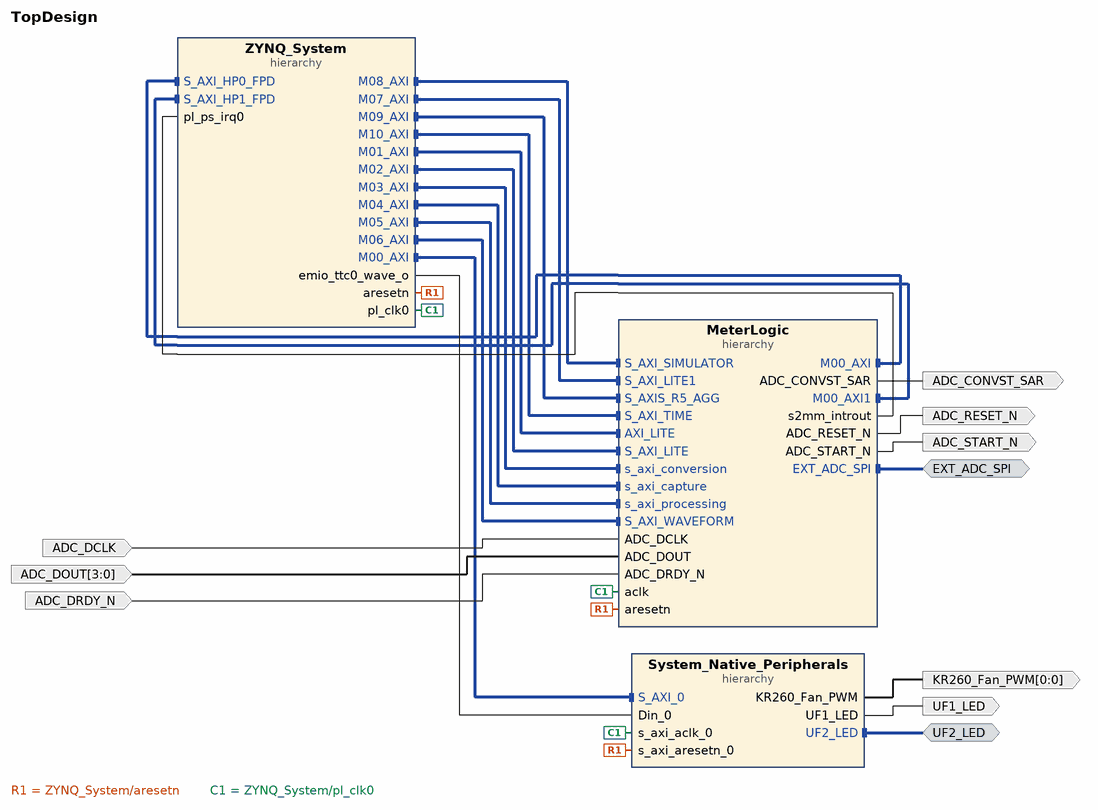
[diagram p0: block diagram of the top level]
# Vivado block design TopDesign, xck26-sfvc784-2LV-c, Vivado 2025.2
create_bd_design TopDesign

create_bd_intf_port -mode Master -vlnv xilinx.com:interface:gpio_rtl:1.0 UF2_LED
create_bd_intf_port -mode Master -vlnv xilinx.com:interface:spi_rtl:1.0 EXT_ADC_SPI
create_bd_port -dir O -from 0 -to 0 KR260_Fan_PWM
create_bd_port -dir O UF1_LED
create_bd_port -dir I -type clk ADC_DCLK
set_property -dict {CONFIG.FREQ_HZ 8192000} [get_bd_ports ADC_DCLK]
create_bd_port -dir O ADC_CONVST_SAR
create_bd_port -dir O ADC_RESET_N
create_bd_port -dir O ADC_START_N
create_bd_port -dir I ADC_DRDY_N
create_bd_port -dir I -from 3 -to 0 ADC_DOUT

create_bd_cell -type hier System_Native_Peripherals
create_bd_cell -type hier MeterLogic
create_bd_cell -type hier ZYNQ_System

# ---- hierarchy /System_Native_Peripherals ----
current_bd_instance /System_Native_Peripherals
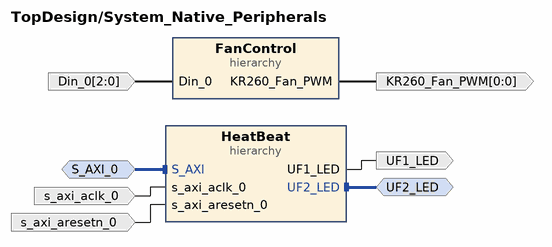
[diagram p1: block diagram inside /System_Native_Peripherals]
create_bd_intf_pin -mode Master -vlnv xilinx.com:interface:gpio_rtl:1.0 UF2_LED
create_bd_intf_pin -mode Slave -vlnv xilinx.com:interface:aximm_rtl:1.0 S_AXI_0
create_bd_pin -dir I -from 2 -to 0 Din_0
create_bd_pin -dir O -from 0 -to 0 KR260_Fan_PWM
create_bd_pin -dir O UF1_LED
create_bd_pin -dir I -type clk s_axi_aclk_0
create_bd_pin -dir I -type rst s_axi_aresetn_0

create_bd_cell -type hier FanControl
create_bd_cell -type hier HeatBeat

# ---- hierarchy /System_Native_Peripherals/FanControl ----
current_bd_instance /System_Native_Peripherals/FanControl
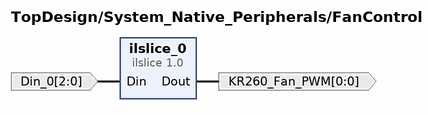
[diagram p2: block diagram inside /System_Native_Peripherals/FanControl]
create_bd_pin -dir I -from 2 -to 0 Din_0
create_bd_pin -dir O -from 0 -to 0 KR260_Fan_PWM

create_bd_cell -type inline_hdl -vlnv xilinx.com:inline_hdl:ilslice:1.0 ilslice_0
set_property -dict {CONFIG.DIN_FROM 2 CONFIG.DIN_TO 2 CONFIG.DIN_WIDTH 3} [get_bd_cells ilslice_0]

# ---- hierarchy /System_Native_Peripherals/HeatBeat ----
current_bd_instance /System_Native_Peripherals/HeatBeat
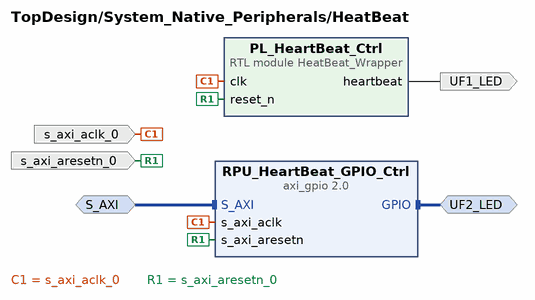
[diagram p3: block diagram inside /System_Native_Peripherals/HeatBeat]
create_bd_intf_pin -mode Slave -vlnv xilinx.com:interface:aximm_rtl:1.0 S_AXI
create_bd_intf_pin -mode Master -vlnv xilinx.com:interface:gpio_rtl:1.0 UF2_LED
create_bd_pin -dir I -type clk s_axi_aclk_0
create_bd_pin -dir I -type rst s_axi_aresetn_0
create_bd_pin -dir O UF1_LED

create_bd_cell -type ip -vlnv xilinx.com:ip:axi_gpio:2.0 RPU_HeartBeat_GPIO_Ctrl
set_property -dict {CONFIG.C_ALL_OUTPUTS 1 CONFIG.C_GPIO_WIDTH 1} [get_bd_cells RPU_HeartBeat_GPIO_Ctrl]
create_bd_cell -type module -reference HeatBeat_Wrapper PL_HeartBeat_Ctrl

# ---- hierarchy /MeterLogic ----
current_bd_instance /MeterLogic
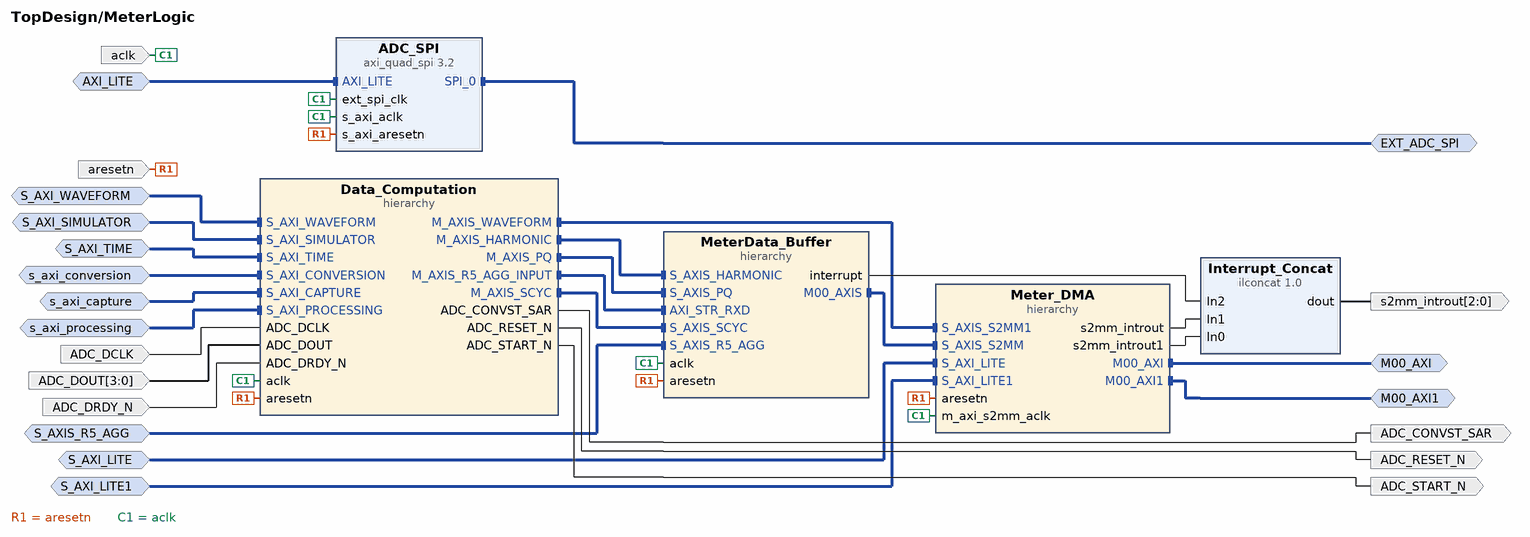
[diagram p4: block diagram inside /MeterLogic]
create_bd_intf_pin -mode Slave -vlnv xilinx.com:interface:aximm_rtl:1.0 AXI_LITE
create_bd_intf_pin -mode Master -vlnv xilinx.com:interface:spi_rtl:1.0 EXT_ADC_SPI
create_bd_intf_pin -mode Slave -vlnv xilinx.com:interface:aximm_rtl:1.0 S_AXI_LITE1
create_bd_intf_pin -mode Slave -vlnv xilinx.com:interface:aximm_rtl:1.0 S_AXI_SIMULATOR
create_bd_intf_pin -mode Slave -vlnv xilinx.com:interface:aximm_rtl:1.0 S_AXI_WAVEFORM
create_bd_intf_pin -mode Slave -vlnv xilinx.com:interface:aximm_rtl:1.0 s_axi_processing
create_bd_intf_pin -mode Slave -vlnv xilinx.com:interface:aximm_rtl:1.0 s_axi_conversion
create_bd_intf_pin -mode Slave -vlnv xilinx.com:interface:aximm_rtl:1.0 s_axi_capture
create_bd_intf_pin -mode Master -vlnv xilinx.com:interface:aximm_rtl:1.0 M00_AXI1
create_bd_intf_pin -mode Master -vlnv xilinx.com:interface:aximm_rtl:1.0 M00_AXI
create_bd_intf_pin -mode Slave -vlnv xilinx.com:interface:aximm_rtl:1.0 S_AXI_LITE
create_bd_intf_pin -mode Slave -vlnv xilinx.com:interface:aximm_rtl:1.0 S_AXIS_R5_AGG
create_bd_intf_pin -mode Slave -vlnv xilinx.com:interface:aximm_rtl:1.0 S_AXI_TIME
create_bd_pin -dir I -type clk aclk
create_bd_pin -dir I -type rst aresetn
create_bd_pin -dir O -from 2 -to 0 -type intr s2mm_introut
create_bd_pin -dir O ADC_CONVST_SAR
create_bd_pin -dir O ADC_START_N
create_bd_pin -dir O ADC_RESET_N
create_bd_pin -dir I -from 3 -to 0 ADC_DOUT
create_bd_pin -dir I ADC_DRDY_N
create_bd_pin -dir I -type clk ADC_DCLK

create_bd_cell -type hier Meter_DMA
create_bd_cell -type ip -vlnv xilinx.com:ip:axi_quad_spi:3.2 ADC_SPI
set_property -dict {CONFIG.Multiples16 2} [get_bd_cells ADC_SPI]
create_bd_cell -type hier MeterData_Buffer
create_bd_cell -type inline_hdl -vlnv xilinx.com:inline_hdl:ilconcat:1.0 Interrupt_Concat
set_property -dict {CONFIG.NUM_PORTS 3} [get_bd_cells Interrupt_Concat]
create_bd_cell -type hier Data_Computation

# ---- hierarchy /MeterLogic/Meter_DMA ----
current_bd_instance /MeterLogic/Meter_DMA
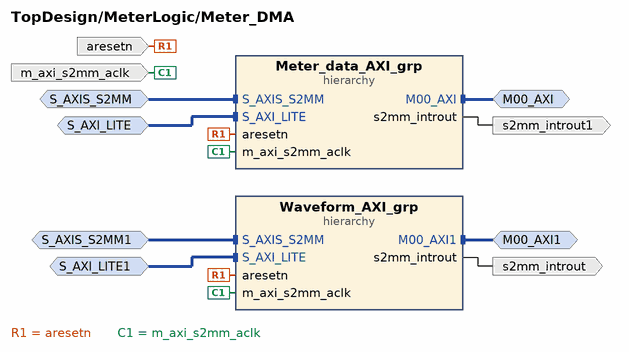
[diagram p5: block diagram inside /MeterLogic/Meter_DMA]
create_bd_intf_pin -mode Slave -vlnv xilinx.com:interface:axis_rtl:1.0 S_AXIS_S2MM1
create_bd_intf_pin -mode Slave -vlnv xilinx.com:interface:aximm_rtl:1.0 S_AXI_LITE1
create_bd_intf_pin -mode Master -vlnv xilinx.com:interface:aximm_rtl:1.0 M00_AXI1
create_bd_intf_pin -mode Master -vlnv xilinx.com:interface:aximm_rtl:1.0 M00_AXI
create_bd_intf_pin -mode Slave -vlnv xilinx.com:interface:axis_rtl:1.0 S_AXIS_S2MM
create_bd_intf_pin -mode Slave -vlnv xilinx.com:interface:aximm_rtl:1.0 S_AXI_LITE
create_bd_pin -dir I -type clk m_axi_s2mm_aclk
create_bd_pin -dir I -type rst aresetn
create_bd_pin -dir O -type intr s2mm_introut
create_bd_pin -dir O -type intr s2mm_introut1

create_bd_cell -type hier Waveform_AXI_grp
create_bd_cell -type hier Meter_data_AXI_grp

# ---- hierarchy /MeterLogic/Meter_DMA/Waveform_AXI_grp ----
current_bd_instance /MeterLogic/Meter_DMA/Waveform_AXI_grp
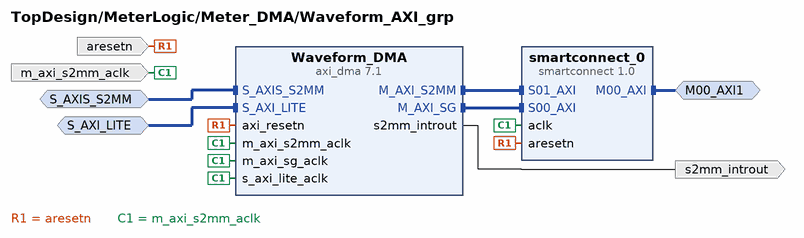
[diagram p6: block diagram inside /MeterLogic/Meter_DMA/Waveform_AXI_grp]
create_bd_intf_pin -mode Slave -vlnv xilinx.com:interface:aximm_rtl:1.0 S_AXI_LITE
create_bd_intf_pin -mode Slave -vlnv xilinx.com:interface:axis_rtl:1.0 S_AXIS_S2MM
create_bd_intf_pin -mode Master -vlnv xilinx.com:interface:aximm_rtl:1.0 M00_AXI1
create_bd_pin -dir I -type clk m_axi_s2mm_aclk
create_bd_pin -dir I -type rst aresetn
create_bd_pin -dir O -type intr s2mm_introut

create_bd_cell -type ip -vlnv xilinx.com:ip:smartconnect:1.0 smartconnect_0
create_bd_cell -type ip -vlnv xilinx.com:ip:axi_dma:7.1 Waveform_DMA
set_property -dict [list \
  CONFIG.c_include_mm2s 0 \
  CONFIG.c_m_axi_s2mm_data_width 128 \
  CONFIG.c_s_axis_s2mm_tdata_width 32 \
  CONFIG.c_sg_include_stscntrl_strm 0 \
  CONFIG.c_sg_length_width 16 \
] [get_bd_cells Waveform_DMA]

# ---- hierarchy /MeterLogic/Meter_DMA/Meter_data_AXI_grp ----
current_bd_instance /MeterLogic/Meter_DMA/Meter_data_AXI_grp
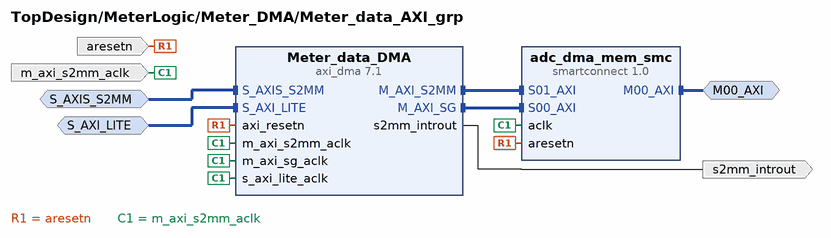
[diagram p7: block diagram inside /MeterLogic/Meter_DMA/Meter_data_AXI_grp]
create_bd_intf_pin -mode Slave -vlnv xilinx.com:interface:aximm_rtl:1.0 S_AXI_LITE
create_bd_intf_pin -mode Slave -vlnv xilinx.com:interface:axis_rtl:1.0 S_AXIS_S2MM
create_bd_intf_pin -mode Master -vlnv xilinx.com:interface:aximm_rtl:1.0 M00_AXI
create_bd_pin -dir I -type clk m_axi_s2mm_aclk
create_bd_pin -dir I -type rst aresetn
create_bd_pin -dir O -type intr s2mm_introut

create_bd_cell -type ip -vlnv xilinx.com:ip:axi_dma:7.1 Meter_data_DMA
set_property -dict [list \
  CONFIG.c_include_mm2s 0 \
  CONFIG.c_include_sg 1 \
  CONFIG.c_m_axi_s2mm_data_width 128 \
  CONFIG.c_s_axis_s2mm_tdata_width 32 \
  CONFIG.c_sg_include_stscntrl_strm 0 \
  CONFIG.c_sg_length_width 16 \
] [get_bd_cells Meter_data_DMA]
create_bd_cell -type ip -vlnv xilinx.com:ip:smartconnect:1.0 adc_dma_mem_smc
set_property -dict {CONFIG.NUM_SI 2} [get_bd_cells adc_dma_mem_smc]

# ---- hierarchy /MeterLogic/MeterData_Buffer ----
current_bd_instance /MeterLogic/MeterData_Buffer
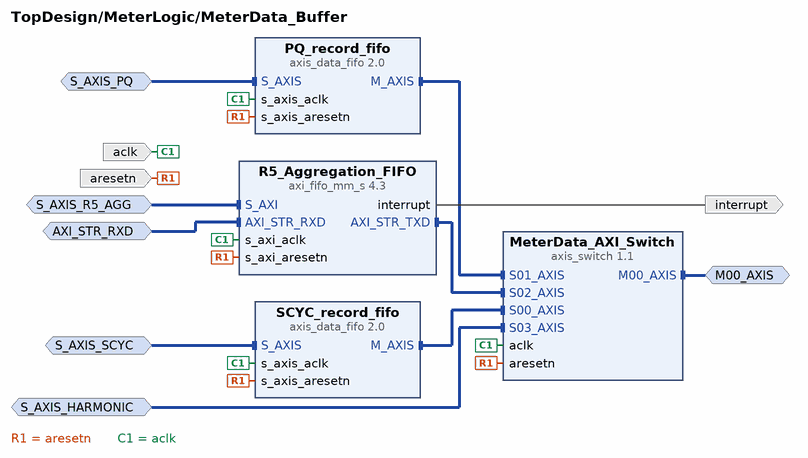
[diagram p8: block diagram inside /MeterLogic/MeterData_Buffer]
create_bd_intf_pin -mode Master -vlnv xilinx.com:interface:axis_rtl:1.0 M00_AXIS
create_bd_intf_pin -mode Slave -vlnv xilinx.com:interface:axis_rtl:1.0 S_AXIS_SCYC
create_bd_intf_pin -mode Slave -vlnv xilinx.com:interface:axis_rtl:1.0 S_AXIS_PQ
create_bd_intf_pin -mode Slave -vlnv xilinx.com:interface:axis_rtl:1.0 AXI_STR_RXD
create_bd_intf_pin -mode Slave -vlnv xilinx.com:interface:aximm_rtl:1.0 S_AXIS_R5_AGG
create_bd_intf_pin -mode Slave -vlnv xilinx.com:interface:axis_rtl:1.0 S_AXIS_HARMONIC
create_bd_pin -dir I -type rst aresetn
create_bd_pin -dir I -type clk aclk
create_bd_pin -dir O -type intr interrupt

create_bd_cell -type ip -vlnv xilinx.com:ip:axis_switch:1.1 MeterData_AXI_Switch
set_property -dict [list \
  CONFIG.ARB_ALGORITHM 3 \
  CONFIG.ARB_ON_MAX_XFERS 0 \
  CONFIG.ARB_ON_TLAST 1 \
  CONFIG.HAS_ACLKEN 0 \
  CONFIG.HAS_TLAST 1 \
  CONFIG.NUM_SI 4 \
] [get_bd_cells MeterData_AXI_Switch]
create_bd_cell -type ip -vlnv xilinx.com:ip:axis_data_fifo:2.0 SCYC_record_fifo
set_property -dict [list \
  CONFIG.ACLKEN_CONV_MODE 0 \
  CONFIG.FIFO_DEPTH 256 \
  CONFIG.FIFO_MEMORY_TYPE auto \
  CONFIG.FIFO_MODE 2 \
  CONFIG.HAS_PROG_EMPTY 0 \
  CONFIG.HAS_PROG_FULL 0 \
  CONFIG.HAS_RD_DATA_COUNT 0 \
  CONFIG.HAS_TKEEP 1 \
  CONFIG.HAS_TSTRB 0 \
  CONFIG.HAS_WR_DATA_COUNT 0 \
  CONFIG.IS_ACLK_ASYNC 0 \
  CONFIG.TDATA_NUM_BYTES 4 \
  CONFIG.TDEST_WIDTH 0 \
  CONFIG.TID_WIDTH 0 \
  CONFIG.TUSER_WIDTH 0 \
] [get_bd_cells SCYC_record_fifo]
create_bd_cell -type ip -vlnv xilinx.com:ip:axis_data_fifo:2.0 PQ_record_fifo
set_property -dict [list \
  CONFIG.ACLKEN_CONV_MODE 0 \
  CONFIG.FIFO_DEPTH 256 \
  CONFIG.FIFO_MEMORY_TYPE auto \
  CONFIG.FIFO_MODE 2 \
  CONFIG.HAS_PROG_EMPTY 0 \
  CONFIG.HAS_PROG_FULL 0 \
  CONFIG.HAS_RD_DATA_COUNT 0 \
  CONFIG.HAS_TKEEP 1 \
  CONFIG.HAS_TSTRB 0 \
  CONFIG.HAS_WR_DATA_COUNT 0 \
  CONFIG.IS_ACLK_ASYNC 0 \
  CONFIG.TDATA_NUM_BYTES 4 \
  CONFIG.TDEST_WIDTH 0 \
  CONFIG.TID_WIDTH 0 \
  CONFIG.TUSER_WIDTH 0 \
] [get_bd_cells PQ_record_fifo]
create_bd_cell -type ip -vlnv xilinx.com:ip:axi_fifo_mm_s:4.3 R5_Aggregation_FIFO
set_property -dict [list \
  CONFIG.C_DATA_INTERFACE_TYPE 0 \
  CONFIG.C_HAS_AXIS_TKEEP true \
  CONFIG.C_RX_FIFO_DEPTH 8192 \
  CONFIG.C_RX_FIFO_PE_THRESHOLD 5 \
  CONFIG.C_RX_FIFO_PF_THRESHOLD 507 \
  CONFIG.C_TX_FIFO_DEPTH 2048 \
  CONFIG.C_TX_FIFO_PE_THRESHOLD 5 \
  CONFIG.C_TX_FIFO_PF_THRESHOLD 507 \
  CONFIG.C_USE_TX_CTRL 0 \
] [get_bd_cells R5_Aggregation_FIFO]

# ---- hierarchy /MeterLogic/Data_Computation ----
current_bd_instance /MeterLogic/Data_Computation
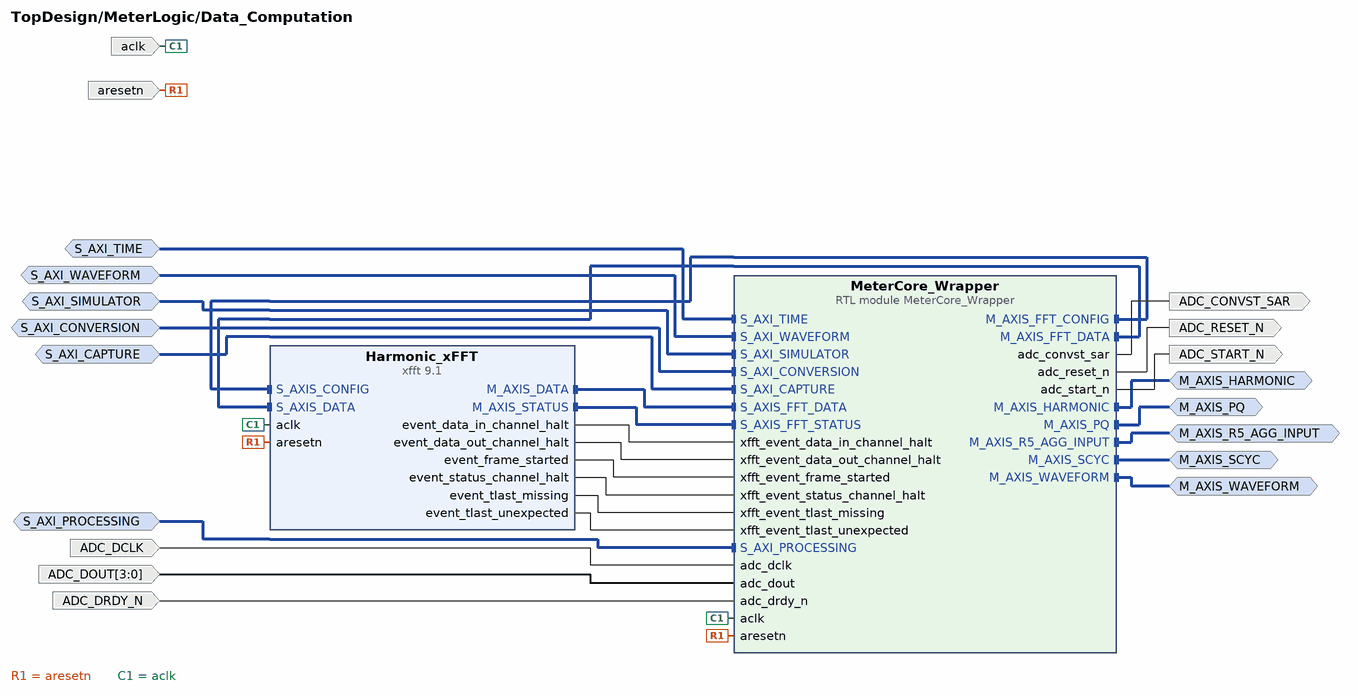
[diagram p9: block diagram inside /MeterLogic/Data_Computation]
create_bd_intf_pin -mode Slave -vlnv xilinx.com:interface:aximm_rtl:1.0 S_AXI_CAPTURE
create_bd_intf_pin -mode Slave -vlnv xilinx.com:interface:aximm_rtl:1.0 S_AXI_CONVERSION
create_bd_intf_pin -mode Slave -vlnv xilinx.com:interface:aximm_rtl:1.0 S_AXI_PROCESSING
create_bd_intf_pin -mode Slave -vlnv xilinx.com:interface:aximm_rtl:1.0 S_AXI_WAVEFORM
create_bd_intf_pin -mode Slave -vlnv xilinx.com:interface:aximm_rtl:1.0 S_AXI_SIMULATOR
create_bd_intf_pin -mode Master -vlnv xilinx.com:interface:axis_rtl:1.0 M_AXIS_PQ
create_bd_intf_pin -mode Master -vlnv xilinx.com:interface:axis_rtl:1.0 M_AXIS_SCYC
create_bd_intf_pin -mode Master -vlnv xilinx.com:interface:axis_rtl:1.0 M_AXIS_R5_AGG_INPUT
create_bd_intf_pin -mode Master -vlnv xilinx.com:interface:axis_rtl:1.0 M_AXIS_WAVEFORM
create_bd_intf_pin -mode Master -vlnv xilinx.com:interface:axis_rtl:1.0 M_AXIS_HARMONIC
create_bd_intf_pin -mode Slave -vlnv xilinx.com:interface:aximm_rtl:1.0 S_AXI_TIME
create_bd_pin -dir I -type clk aclk
create_bd_pin -dir I -type rst aresetn
create_bd_pin -dir I -type clk ADC_DCLK
create_bd_pin -dir I ADC_DRDY_N
create_bd_pin -dir I -from 3 -to 0 ADC_DOUT
create_bd_pin -dir O ADC_RESET_N
create_bd_pin -dir O ADC_START_N
create_bd_pin -dir O ADC_CONVST_SAR

create_bd_cell -type module -reference MeterCore_Wrapper MeterCore_Wrapper
create_bd_cell -type ip -vlnv xilinx.com:ip:xfft:9.1 Harmonic_xFFT
set_property -dict [list \
  CONFIG.aresetn true \
  CONFIG.butterfly_type use_luts \
  CONFIG.channels 1 \
  CONFIG.complex_mult_type use_mults_resources \
  CONFIG.data_format fixed_point \
  CONFIG.implementation_options radix_2_lite_burst_io \
  CONFIG.input_width 24 \
  CONFIG.memory_options_data block_ram \
  CONFIG.memory_options_phase_factors block_ram \
  CONFIG.memory_options_reorder block_ram \
  CONFIG.output_ordering bit_reversed_order \
  CONFIG.phase_factor_width 24 \
  CONFIG.scaling_options block_floating_point \
  CONFIG.target_clock_frequency 100 \
  CONFIG.transform_length 4096 \
  CONFIG.xk_index true \
] [get_bd_cells Harmonic_xFFT]

# ---- hierarchy /ZYNQ_System ----
current_bd_instance /ZYNQ_System
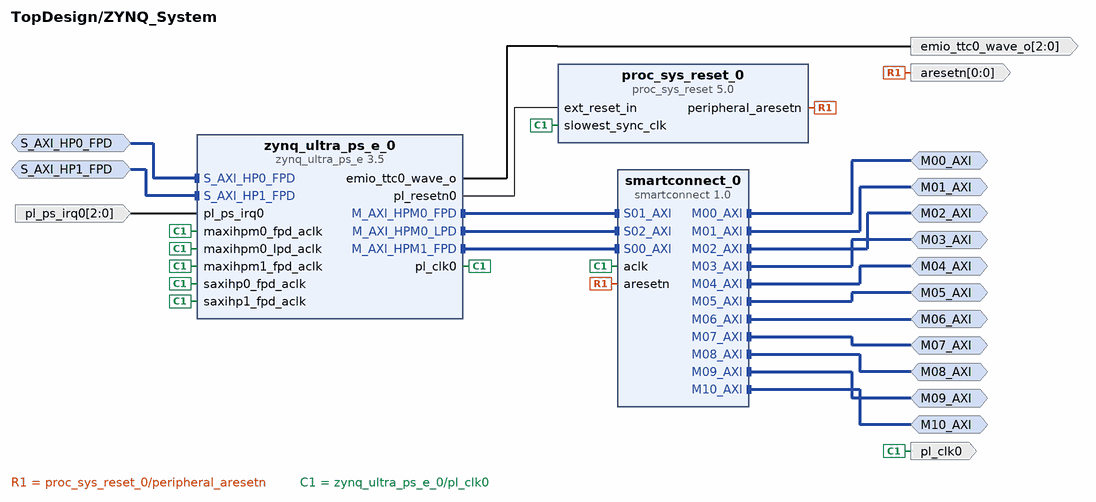
[diagram p10: block diagram inside /ZYNQ_System]
create_bd_intf_pin -mode Slave -vlnv xilinx.com:interface:aximm_rtl:1.0 S_AXI_HP0_FPD
create_bd_intf_pin -mode Master -vlnv xilinx.com:interface:aximm_rtl:1.0 M00_AXI
create_bd_intf_pin -mode Master -vlnv xilinx.com:interface:aximm_rtl:1.0 M01_AXI
create_bd_intf_pin -mode Master -vlnv xilinx.com:interface:aximm_rtl:1.0 M02_AXI
create_bd_intf_pin -mode Master -vlnv xilinx.com:interface:aximm_rtl:1.0 M03_AXI
create_bd_intf_pin -mode Master -vlnv xilinx.com:interface:aximm_rtl:1.0 M04_AXI
create_bd_intf_pin -mode Master -vlnv xilinx.com:interface:aximm_rtl:1.0 M05_AXI
create_bd_intf_pin -mode Master -vlnv xilinx.com:interface:aximm_rtl:1.0 M06_AXI
create_bd_intf_pin -mode Master -vlnv xilinx.com:interface:aximm_rtl:1.0 M07_AXI
create_bd_intf_pin -mode Master -vlnv xilinx.com:interface:aximm_rtl:1.0 M08_AXI
create_bd_intf_pin -mode Slave -vlnv xilinx.com:interface:aximm_rtl:1.0 S_AXI_HP1_FPD
create_bd_intf_pin -mode Master -vlnv xilinx.com:interface:aximm_rtl:1.0 M09_AXI
create_bd_intf_pin -mode Master -vlnv xilinx.com:interface:aximm_rtl:1.0 M10_AXI
create_bd_pin -dir O -type clk pl_clk0
create_bd_pin -dir O -from 2 -to 0 emio_ttc0_wave_o
create_bd_pin -dir I -from 2 -to 0 -type intr pl_ps_irq0
create_bd_pin -dir O -from 0 -to 0 -type rst aresetn

create_bd_cell -type ip -vlnv xilinx.com:ip:zynq_ultra_ps_e:3.5 zynq_ultra_ps_e_0
set_property -dict [list \
  CONFIG.PSU_BANK_0_IO_STANDARD LVCMOS18 \
  CONFIG.PSU_BANK_1_IO_STANDARD LVCMOS18 \
  CONFIG.PSU_BANK_2_IO_STANDARD LVCMOS18 \
  CONFIG.PSU_BANK_3_IO_STANDARD LVCMOS18 \
  CONFIG.PSU_USB3__DUAL_CLOCK_ENABLE 1 \
  CONFIG.PSU__CRF_APB__ACPU_CTRL__FREQMHZ 1333.333 \
  CONFIG.PSU__CRF_APB__ACPU_CTRL__SRCSEL APLL \
  CONFIG.PSU__CRF_APB__APLL_CTRL__SRCSEL PSS_REF_CLK \
  CONFIG.PSU__CRF_APB__APLL_FRAC_CFG__ENABLED 1 \
  CONFIG.PSU__CRF_APB__DBG_FPD_CTRL__FREQMHZ 250 \
  CONFIG.PSU__CRF_APB__DBG_FPD_CTRL__SRCSEL IOPLL \
  CONFIG.PSU__CRF_APB__DBG_TRACE_CTRL__FREQMHZ 250 \
  CONFIG.PSU__CRF_APB__DBG_TRACE_CTRL__SRCSEL IOPLL \
  CONFIG.PSU__CRF_APB__DBG_TSTMP_CTRL__FREQMHZ 250 \
  CONFIG.PSU__CRF_APB__DBG_TSTMP_CTRL__SRCSEL IOPLL \
  CONFIG.PSU__CRF_APB__DDR_CTRL__FREQMHZ 1200 \
  CONFIG.PSU__CRF_APB__DDR_CTRL__SRCSEL DPLL \
  CONFIG.PSU__CRF_APB__DPDMA_REF_CTRL__FREQMHZ 600 \
  CONFIG.PSU__CRF_APB__DPDMA_REF_CTRL__SRCSEL APLL \
  CONFIG.PSU__CRF_APB__DPLL_CTRL__SRCSEL PSS_REF_CLK \
  CONFIG.PSU__CRF_APB__DP_AUDIO_REF_CTRL__SRCSEL RPLL \
  CONFIG.PSU__CRF_APB__DP_STC_REF_CTRL__SRCSEL RPLL \
  CONFIG.PSU__CRF_APB__DP_VIDEO_REF_CTRL__SRCSEL VPLL \
  CONFIG.PSU__CRF_APB__GDMA_REF_CTRL__FREQMHZ 600 \
  CONFIG.PSU__CRF_APB__GDMA_REF_CTRL__SRCSEL DPLL \
  CONFIG.PSU__CRF_APB__GPU_REF_CTRL__FREQMHZ 600 \
  CONFIG.PSU__CRF_APB__GPU_REF_CTRL__SRCSEL IOPLL \
  CONFIG.PSU__CRF_APB__TOPSW_LSBUS_CTRL__FREQMHZ 100 \
  CONFIG.PSU__CRF_APB__TOPSW_LSBUS_CTRL__SRCSEL IOPLL \
  CONFIG.PSU__CRF_APB__TOPSW_MAIN_CTRL__FREQMHZ 533.33 \
  CONFIG.PSU__CRF_APB__TOPSW_MAIN_CTRL__SRCSEL DPLL \
  CONFIG.PSU__CRF_APB__VPLL_CTRL__SRCSEL PSS_REF_CLK \
  CONFIG.PSU__CRL_APB__ADMA_REF_CTRL__FREQMHZ 500 \
  CONFIG.PSU__CRL_APB__ADMA_REF_CTRL__SRCSEL IOPLL \
  CONFIG.PSU__CRL_APB__CPU_R5_CTRL__FREQMHZ 533.333 \
  CONFIG.PSU__CRL_APB__CPU_R5_CTRL__SRCSEL RPLL \
  CONFIG.PSU__CRL_APB__DBG_LPD_CTRL__FREQMHZ 250 \
  CONFIG.PSU__CRL_APB__DBG_LPD_CTRL__SRCSEL IOPLL \
  CONFIG.PSU__CRL_APB__I2C1_REF_CTRL__FREQMHZ 100 \
  CONFIG.PSU__CRL_APB__I2C1_REF_CTRL__SRCSEL IOPLL \
  CONFIG.PSU__CRL_APB__IOPLL_CTRL__SRCSEL PSS_REF_CLK \
  CONFIG.PSU__CRL_APB__IOU_SWITCH_CTRL__FREQMHZ 250 \
  CONFIG.PSU__CRL_APB__IOU_SWITCH_CTRL__SRCSEL IOPLL \
  CONFIG.PSU__CRL_APB__LPD_LSBUS_CTRL__FREQMHZ 100 \
  CONFIG.PSU__CRL_APB__LPD_LSBUS_CTRL__SRCSEL IOPLL \
  CONFIG.PSU__CRL_APB__LPD_SWITCH_CTRL__FREQMHZ 500 \
  CONFIG.PSU__CRL_APB__LPD_SWITCH_CTRL__SRCSEL IOPLL \
  CONFIG.PSU__CRL_APB__PCAP_CTRL__FREQMHZ 200 \
  CONFIG.PSU__CRL_APB__PCAP_CTRL__SRCSEL IOPLL \
  CONFIG.PSU__CRL_APB__PL0_REF_CTRL__FREQMHZ 100 \
  CONFIG.PSU__CRL_APB__PL0_REF_CTRL__SRCSEL IOPLL \
  CONFIG.PSU__CRL_APB__PL1_REF_CTRL__SRCSEL IOPLL \
  CONFIG.PSU__CRL_APB__QSPI_REF_CTRL__FREQMHZ 125 \
  CONFIG.PSU__CRL_APB__QSPI_REF_CTRL__SRCSEL IOPLL \
  CONFIG.PSU__CRL_APB__RPLL_CTRL__SRCSEL PSS_REF_CLK \
  CONFIG.PSU__CRL_APB__SPI1_REF_CTRL__SRCSEL IOPLL \
  CONFIG.PSU__CRL_APB__TIMESTAMP_REF_CTRL__FREQMHZ 100 \
  CONFIG.PSU__CRL_APB__TIMESTAMP_REF_CTRL__SRCSEL IOPLL \
  CONFIG.PSU__CRL_APB__UART1_REF_CTRL__FREQMHZ 100 \
  CONFIG.PSU__CRL_APB__UART1_REF_CTRL__SRCSEL IOPLL \
  CONFIG.PSU__CRL_APB__USB0_BUS_REF_CTRL__FREQMHZ 250 \
  CONFIG.PSU__CRL_APB__USB0_BUS_REF_CTRL__SRCSEL IOPLL \
  CONFIG.PSU__CRL_APB__USB3_DUAL_REF_CTRL__FREQMHZ 20 \
  CONFIG.PSU__CRL_APB__USB3_DUAL_REF_CTRL__SRCSEL IOPLL \
  CONFIG.PSU__CRL_APB__USB3__ENABLE 1 \
  CONFIG.PSU__CSUPMU__PERIPHERAL__VALID 1 \
  CONFIG.PSU__DDRC__BUS_WIDTH {64 Bit} \
  CONFIG.PSU__DDRC__COMPONENTS Components \
  CONFIG.PSU__DDRC__DEVICE_CAPACITY {8192 MBits} \
  CONFIG.PSU__DDRC__DRAM_WIDTH {16 Bits} \
  CONFIG.PSU__DDRC__ECC Disabled \
  CONFIG.PSU__DDRC__MEMORY_TYPE {DDR 4} \
  CONFIG.PSU__DDRC__SPEED_BIN DDR4_2400R \
  CONFIG.PSU__DDR_HIGH_ADDRESS_GUI_ENABLE 1 \
  CONFIG.PSU__DDR__INTERFACE__FREQMHZ 600.000 \
  CONFIG.PSU__DISPLAYPORT__LANE0__ENABLE 1 \
  CONFIG.PSU__DISPLAYPORT__LANE0__IO {GT Lane1} \
  CONFIG.PSU__DISPLAYPORT__LANE1__ENABLE 0 \
  CONFIG.PSU__DISPLAYPORT__PERIPHERAL__ENABLE 1 \
  CONFIG.PSU__DPAUX__PERIPHERAL__ENABLE 1 \
  CONFIG.PSU__DPAUX__PERIPHERAL__IO {MIO 27 .. 30} \
  CONFIG.PSU__DP__LANE_SEL {Single Lower} \
  CONFIG.PSU__DP__REF_CLK_FREQ 27 \
  CONFIG.PSU__DP__REF_CLK_SEL {Ref Clk1} \
  CONFIG.PSU__ENET0__PERIPHERAL__ENABLE 1 \
  CONFIG.PSU__ENET0__PERIPHERAL__IO {GT Lane0} \
  CONFIG.PSU__ENET1__GRP_MDIO__ENABLE 1 \
  CONFIG.PSU__ENET1__GRP_MDIO__IO {MIO 50 .. 51} \
  CONFIG.PSU__ENET1__PERIPHERAL__ENABLE 1 \
  CONFIG.PSU__ENET1__PERIPHERAL__IO {MIO 38 .. 49} \
  CONFIG.PSU__FPGA_PL0_ENABLE 1 \
  CONFIG.PSU__FPGA_PL1_ENABLE 1 \
  CONFIG.PSU__GEM0__REF_CLK_FREQ 125 \
  CONFIG.PSU__GEM0__REF_CLK_SEL {Ref Clk0} \
  CONFIG.PSU__GEM__TSU__ENABLE 0 \
  CONFIG.PSU__GEN_IPI_7__MASTER APU \
  CONFIG.PSU__GPIO0_MIO__IO {MIO 0 .. 25} \
  CONFIG.PSU__GPIO0_MIO__PERIPHERAL__ENABLE 1 \
  CONFIG.PSU__GPIO1_MIO__IO {MIO 26 .. 51} \
  CONFIG.PSU__GPIO1_MIO__PERIPHERAL__ENABLE 1 \
  CONFIG.PSU__GT__LINK_SPEED HBR \
  CONFIG.PSU__GT__PRE_EMPH_LVL_4 0 \
  CONFIG.PSU__GT__VLT_SWNG_LVL_4 0 \
  CONFIG.PSU__I2C1__PERIPHERAL__ENABLE 1 \
  CONFIG.PSU__I2C1__PERIPHERAL__IO {MIO 24 .. 25} \
  CONFIG.PSU__IOU_SLCR__IOU_TTC_APB_CLK__TTC0_SEL APB \
  CONFIG.PSU__IOU_SLCR__IOU_TTC_APB_CLK__TTC1_SEL APB \
  CONFIG.PSU__IOU_SLCR__IOU_TTC_APB_CLK__TTC2_SEL APB \
  CONFIG.PSU__IOU_SLCR__IOU_TTC_APB_CLK__TTC3_SEL APB \
  CONFIG.PSU__MAXIGP0__DATA_WIDTH 128 \
  CONFIG.PSU__MAXIGP2__DATA_WIDTH 128 \
  CONFIG.PSU__OVERRIDE__BASIC_CLOCK 0 \
  CONFIG.PSU__PMU_COHERENCY 0 \
  CONFIG.PSU__PMU__AIBACK__ENABLE 0 \
  CONFIG.PSU__PMU__EMIO_GPI__ENABLE 0 \
  CONFIG.PSU__PMU__EMIO_GPO__ENABLE 0 \
  CONFIG.PSU__PMU__GPI0__ENABLE 1 \
  CONFIG.PSU__PMU__GPI0__IO {MIO 26} \
  CONFIG.PSU__PMU__GPI1__ENABLE 0 \
  CONFIG.PSU__PMU__GPI2__ENABLE 0 \
  CONFIG.PSU__PMU__GPI3__ENABLE 0 \
  CONFIG.PSU__PMU__GPI4__ENABLE 0 \
  CONFIG.PSU__PMU__GPI5__ENABLE 1 \
  CONFIG.PSU__PMU__GPI5__IO {MIO 31} \
  CONFIG.PSU__PMU__GPO0__ENABLE 0 \
  CONFIG.PSU__PMU__GPO1__ENABLE 0 \
  CONFIG.PSU__PMU__GPO2__ENABLE 0 \
  CONFIG.PSU__PMU__GPO3__ENABLE 1 \
  CONFIG.PSU__PMU__GPO3__IO {MIO 35} \
  CONFIG.PSU__PMU__GPO3__POLARITY low \
  CONFIG.PSU__PMU__GPO4__ENABLE 0 \
  CONFIG.PSU__PMU__GPO5__ENABLE 0 \
  CONFIG.PSU__PMU__PERIPHERAL__ENABLE 1 \
  CONFIG.PSU__PMU__PLERROR__ENABLE 0 \
  CONFIG.PSU__PRESET_APPLIED 1 \
  CONFIG.PSU__PSS_REF_CLK__FREQMHZ 33.333 \
  CONFIG.PSU__QSPI_COHERENCY 0 \
  CONFIG.PSU__QSPI_ROUTE_THROUGH_FPD 0 \
  CONFIG.PSU__QSPI__GRP_FBCLK__ENABLE 0 \
  CONFIG.PSU__QSPI__PERIPHERAL__DATA_MODE x4 \
  CONFIG.PSU__QSPI__PERIPHERAL__ENABLE 1 \
  CONFIG.PSU__QSPI__PERIPHERAL__IO {MIO 0 .. 5} \
  CONFIG.PSU__QSPI__PERIPHERAL__MODE Single \
  CONFIG.PSU__SPI1__GRP_SS0__IO {MIO 9} \
  CONFIG.PSU__SPI1__PERIPHERAL__ENABLE 1 \
  CONFIG.PSU__SPI1__PERIPHERAL__IO {MIO 6 .. 11} \
  CONFIG.PSU__SWDT0__CLOCK__ENABLE 0 \
  CONFIG.PSU__SWDT0__PERIPHERAL__ENABLE 1 \
  CONFIG.PSU__SWDT0__RESET__ENABLE 0 \
  CONFIG.PSU__SWDT1__CLOCK__ENABLE 0 \
  CONFIG.PSU__SWDT1__PERIPHERAL__ENABLE 1 \
  CONFIG.PSU__SWDT1__RESET__ENABLE 0 \
  CONFIG.PSU__TSU__BUFG_PORT_PAIR 0 \
  CONFIG.PSU__TTC0__CLOCK__ENABLE 0 \
  CONFIG.PSU__TTC0__PERIPHERAL__ENABLE 1 \
  CONFIG.PSU__TTC0__WAVEOUT__ENABLE 1 \
  CONFIG.PSU__TTC0__WAVEOUT__IO EMIO \
  CONFIG.PSU__TTC1__CLOCK__ENABLE 0 \
  CONFIG.PSU__TTC1__PERIPHERAL__ENABLE 1 \
  CONFIG.PSU__TTC1__WAVEOUT__ENABLE 0 \
  CONFIG.PSU__TTC2__CLOCK__ENABLE 0 \
  CONFIG.PSU__TTC2__PERIPHERAL__ENABLE 1 \
  CONFIG.PSU__TTC2__WAVEOUT__ENABLE 0 \
  CONFIG.PSU__TTC3__CLOCK__ENABLE 0 \
  CONFIG.PSU__TTC3__PERIPHERAL__ENABLE 1 \
  CONFIG.PSU__TTC3__WAVEOUT__ENABLE 0 \
  CONFIG.PSU__UART1__BAUD_RATE 115200 \
  CONFIG.PSU__UART1__MODEM__ENABLE 0 \
  CONFIG.PSU__UART1__PERIPHERAL__ENABLE 1 \
  CONFIG.PSU__UART1__PERIPHERAL__IO {MIO 36 .. 37} \
  CONFIG.PSU__USB0_COHERENCY 0 \
  CONFIG.PSU__USB0__PERIPHERAL__ENABLE 1 \
  CONFIG.PSU__USB0__PERIPHERAL__IO {MIO 52 .. 63} \
  CONFIG.PSU__USB0__REF_CLK_FREQ 26 \
  CONFIG.PSU__USB0__REF_CLK_SEL {Ref Clk2} \
  CONFIG.PSU__USB0__RESET__ENABLE 1 \
  CONFIG.PSU__USB0__RESET__IO {MIO 76} \
  CONFIG.PSU__USB1__PERIPHERAL__ENABLE 1 \
  CONFIG.PSU__USB1__PERIPHERAL__IO {MIO 64 .. 75} \
  CONFIG.PSU__USB1__REF_CLK_FREQ 26 \
  CONFIG.PSU__USB1__REF_CLK_SEL {Ref Clk3} \
  CONFIG.PSU__USB1__RESET__ENABLE 1 \
  CONFIG.PSU__USB1__RESET__IO {MIO 77} \
  CONFIG.PSU__USB2_0__EMIO__ENABLE 0 \
  CONFIG.PSU__USB3_0__EMIO__ENABLE 0 \
  CONFIG.PSU__USB3_0__PERIPHERAL__ENABLE 1 \
  CONFIG.PSU__USB3_0__PERIPHERAL__IO {GT Lane2} \
  CONFIG.PSU__USB3_1__PERIPHERAL__ENABLE 1 \
  CONFIG.PSU__USB3_1__PERIPHERAL__IO {GT Lane3} \
  CONFIG.PSU__USB__RESET__MODE {Separate MIO Pin} \
  CONFIG.PSU__USB__RESET__POLARITY {Active Low} \
  CONFIG.PSU__USE__IRQ0 1 \
  CONFIG.PSU__USE__M_AXI_GP0 1 \
  CONFIG.PSU__USE__M_AXI_GP1 1 \
  CONFIG.PSU__USE__M_AXI_GP2 1 \
  CONFIG.PSU__USE__S_AXI_GP2 1 \
  CONFIG.PSU__USE__S_AXI_GP3 1 \
] [get_bd_cells zynq_ultra_ps_e_0]
# 259 more settings of zynq_ultra_ps_e_0 are not shown: defaults, MIO pin electricals, DDR timing, and values the tool derives
create_bd_cell -type ip -vlnv xilinx.com:ip:proc_sys_reset:5.0 proc_sys_reset_0
set_property -dict {CONFIG.RESET_BOARD_INTERFACE Custom CONFIG.USE_BOARD_FLOW true} [get_bd_cells proc_sys_reset_0]
create_bd_cell -type ip -vlnv xilinx.com:ip:smartconnect:1.0 smartconnect_0
set_property -dict {CONFIG.NUM_MI 11 CONFIG.NUM_SI 3} [get_bd_cells smartconnect_0]

# ---- connections ----

current_bd_instance /System_Native_Peripherals
connect_bd_intf_net -intf_net S_AXI_0_1 [get_bd_intf_pins S_AXI_0] [get_bd_intf_pins HeatBeat/S_AXI]
connect_bd_intf_net -intf_net axi_gpio_0_GPIO [get_bd_intf_pins UF2_LED] [get_bd_intf_pins HeatBeat/UF2_LED]
connect_bd_net -net Din_0_1 [get_bd_pins Din_0] [get_bd_pins FanControl/Din_0]
connect_bd_net -net HeatBeat_Wrapper_0_heartbeat [get_bd_pins HeatBeat/UF1_LED] [get_bd_pins UF1_LED]
connect_bd_net -net ilslice_0_Dout [get_bd_pins FanControl/KR260_Fan_PWM] [get_bd_pins KR260_Fan_PWM]
connect_bd_net -net s_axi_aclk_0_1 [get_bd_pins s_axi_aclk_0] [get_bd_pins HeatBeat/s_axi_aclk_0]
connect_bd_net -net s_axi_aresetn_0_1 [get_bd_pins s_axi_aresetn_0] [get_bd_pins HeatBeat/s_axi_aresetn_0]

current_bd_instance /System_Native_Peripherals/FanControl
connect_bd_net -net Din_0_1 [get_bd_pins Din_0] [get_bd_pins ilslice_0/Din]
connect_bd_net [get_bd_pins ilslice_0/Dout] [get_bd_pins KR260_Fan_PWM]

current_bd_instance /System_Native_Peripherals/HeatBeat
connect_bd_intf_net -intf_net S_AXI_0_1 [get_bd_intf_pins S_AXI] [get_bd_intf_pins RPU_HeartBeat_GPIO_Ctrl/S_AXI]
connect_bd_intf_net -intf_net axi_gpio_0_GPIO [get_bd_intf_pins UF2_LED] [get_bd_intf_pins RPU_HeartBeat_GPIO_Ctrl/GPIO]
connect_bd_net -net HeatBeat_Wrapper_0_heartbeat [get_bd_pins PL_HeartBeat_Ctrl/heartbeat] [get_bd_pins UF1_LED]
connect_bd_net -net s_axi_aclk_0_1 [get_bd_pins s_axi_aclk_0] [get_bd_pins RPU_HeartBeat_GPIO_Ctrl/s_axi_aclk] [get_bd_pins PL_HeartBeat_Ctrl/clk]
connect_bd_net -net s_axi_aresetn_0_1 [get_bd_pins s_axi_aresetn_0] \
  [get_bd_pins RPU_HeartBeat_GPIO_Ctrl/s_axi_aresetn] [get_bd_pins PL_HeartBeat_Ctrl/reset_n]

current_bd_instance /MeterLogic
connect_bd_intf_net [get_bd_intf_pins M00_AXI] [get_bd_intf_pins Meter_DMA/M00_AXI]
connect_bd_intf_net [get_bd_intf_pins S_AXI_LITE] [get_bd_intf_pins Meter_DMA/S_AXI_LITE]
connect_bd_intf_net [get_bd_intf_pins S_AXI_WAVEFORM] [get_bd_intf_pins Data_Computation/S_AXI_WAVEFORM]
connect_bd_intf_net [get_bd_intf_pins Data_Computation/M_AXIS_HARMONIC] [get_bd_intf_pins MeterData_Buffer/S_AXIS_HARMONIC]
connect_bd_intf_net -intf_net MeterCore_Wrapper_M_AXIS_PQ [get_bd_intf_pins Data_Computation/M_AXIS_PQ] [get_bd_intf_pins MeterData_Buffer/S_AXIS_PQ]
connect_bd_intf_net -intf_net MeterCore_Wrapper_M_AXIS_R5_AGG_INPUT [get_bd_intf_pins Data_Computation/M_AXIS_R5_AGG_INPUT] [get_bd_intf_pins MeterData_Buffer/AXI_STR_RXD]
connect_bd_intf_net -intf_net MeterCore_Wrapper_M_AXIS_SCYC [get_bd_intf_pins Data_Computation/M_AXIS_SCYC] [get_bd_intf_pins MeterData_Buffer/S_AXIS_SCYC]
connect_bd_intf_net -intf_net MeterCore_Wrapper_M_AXIS_WAVEFORM [get_bd_intf_pins Meter_DMA/S_AXIS_S2MM1] [get_bd_intf_pins Data_Computation/M_AXIS_WAVEFORM]
connect_bd_intf_net [get_bd_intf_pins M00_AXI1] [get_bd_intf_pins Meter_DMA/M00_AXI1]
connect_bd_intf_net -intf_net S_AXI_1 [get_bd_intf_pins S_AXIS_R5_AGG] [get_bd_intf_pins MeterData_Buffer/S_AXIS_R5_AGG]
connect_bd_intf_net -intf_net S_AXI_LITE1_1 [get_bd_intf_pins S_AXI_LITE1] [get_bd_intf_pins Meter_DMA/S_AXI_LITE1]
connect_bd_intf_net [get_bd_intf_pins S_AXI_SIMULATOR] [get_bd_intf_pins Data_Computation/S_AXI_SIMULATOR]
connect_bd_intf_net [get_bd_intf_pins S_AXI_TIME] [get_bd_intf_pins Data_Computation/S_AXI_TIME]
connect_bd_intf_net -intf_net axi_quad_spi_0_SPI_0 [get_bd_intf_pins EXT_ADC_SPI] [get_bd_intf_pins ADC_SPI/SPI_0]
connect_bd_intf_net -intf_net axis_switch_0_M00_AXIS [get_bd_intf_pins MeterData_Buffer/M00_AXIS] [get_bd_intf_pins Meter_DMA/S_AXIS_S2MM]
connect_bd_intf_net -intf_net smartconnect_0_M01_AXI [get_bd_intf_pins AXI_LITE] [get_bd_intf_pins ADC_SPI/AXI_LITE]
connect_bd_intf_net -intf_net smartconnect_0_M03_AXI [get_bd_intf_pins s_axi_conversion] [get_bd_intf_pins Data_Computation/S_AXI_CONVERSION]
connect_bd_intf_net -intf_net smartconnect_0_M04_AXI [get_bd_intf_pins s_axi_capture] [get_bd_intf_pins Data_Computation/S_AXI_CAPTURE]
connect_bd_intf_net -intf_net smartconnect_0_M05_AXI [get_bd_intf_pins s_axi_processing] [get_bd_intf_pins Data_Computation/S_AXI_PROCESSING]
connect_bd_net [get_bd_pins ADC_DCLK] [get_bd_pins Data_Computation/ADC_DCLK]
connect_bd_net [get_bd_pins ADC_DOUT] [get_bd_pins Data_Computation/ADC_DOUT]
connect_bd_net [get_bd_pins ADC_DRDY_N] [get_bd_pins Data_Computation/ADC_DRDY_N]
connect_bd_net [get_bd_pins Interrupt_Concat/dout] [get_bd_pins s2mm_introut]
connect_bd_net -net MTR_Buffer_interrupt [get_bd_pins MeterData_Buffer/interrupt] [get_bd_pins Interrupt_Concat/In2]
connect_bd_net -net MeterCore_Wrapper_0_adc_convst_sar [get_bd_pins Data_Computation/ADC_CONVST_SAR] [get_bd_pins ADC_CONVST_SAR]
connect_bd_net -net MeterCore_Wrapper_0_adc_reset_n [get_bd_pins Data_Computation/ADC_RESET_N] [get_bd_pins ADC_RESET_N]
connect_bd_net -net MeterCore_Wrapper_0_adc_start_n [get_bd_pins Data_Computation/ADC_START_N] [get_bd_pins ADC_START_N]
connect_bd_net [get_bd_pins Meter_DMA/s2mm_introut] [get_bd_pins Interrupt_Concat/In1]
connect_bd_net [get_bd_pins Meter_DMA/s2mm_introut1] [get_bd_pins Interrupt_Concat/In0]
connect_bd_net -net proc_sys_reset_0_peripheral_aresetn [get_bd_pins aresetn] \
  [get_bd_pins Meter_DMA/aresetn] [get_bd_pins ADC_SPI/s_axi_aresetn] [get_bd_pins MeterData_Buffer/aresetn] \
  [get_bd_pins Data_Computation/aresetn]
connect_bd_net -net zynq_ultra_ps_e_0_pl_clk0 [get_bd_pins aclk] \
  [get_bd_pins Meter_DMA/m_axi_s2mm_aclk] [get_bd_pins ADC_SPI/ext_spi_clk] [get_bd_pins ADC_SPI/s_axi_aclk] \
  [get_bd_pins MeterData_Buffer/aclk] [get_bd_pins Data_Computation/aclk]

current_bd_instance /MeterLogic/Meter_DMA
connect_bd_intf_net [get_bd_intf_pins Waveform_AXI_grp/S_AXIS_S2MM] [get_bd_intf_pins S_AXIS_S2MM1]
connect_bd_intf_net [get_bd_intf_pins Waveform_AXI_grp/S_AXI_LITE] [get_bd_intf_pins S_AXI_LITE1]
connect_bd_intf_net [get_bd_intf_pins Waveform_AXI_grp/M00_AXI1] [get_bd_intf_pins M00_AXI1]
connect_bd_intf_net [get_bd_intf_pins S_AXIS_S2MM] [get_bd_intf_pins Meter_data_AXI_grp/S_AXIS_S2MM]
connect_bd_intf_net -intf_net adc_dma_mem_smc_M00_AXI [get_bd_intf_pins M00_AXI] [get_bd_intf_pins Meter_data_AXI_grp/M00_AXI]
connect_bd_intf_net -intf_net smartconnect_0_M02_AXI [get_bd_intf_pins S_AXI_LITE] [get_bd_intf_pins Meter_data_AXI_grp/S_AXI_LITE]
connect_bd_net [get_bd_pins Meter_data_AXI_grp/s2mm_introut] [get_bd_pins s2mm_introut1]
connect_bd_net [get_bd_pins Waveform_AXI_grp/s2mm_introut] [get_bd_pins s2mm_introut]
connect_bd_net -net proc_sys_reset_0_peripheral_aresetn [get_bd_pins aresetn] \
  [get_bd_pins Waveform_AXI_grp/aresetn] [get_bd_pins Meter_data_AXI_grp/aresetn]
connect_bd_net -net zynq_ultra_ps_e_0_pl_clk0 [get_bd_pins m_axi_s2mm_aclk] \
  [get_bd_pins Waveform_AXI_grp/m_axi_s2mm_aclk] [get_bd_pins Meter_data_AXI_grp/m_axi_s2mm_aclk]

current_bd_instance /MeterLogic/Meter_DMA/Waveform_AXI_grp
connect_bd_intf_net [get_bd_intf_pins S_AXIS_S2MM] [get_bd_intf_pins Waveform_DMA/S_AXIS_S2MM]
connect_bd_intf_net [get_bd_intf_pins S_AXI_LITE] [get_bd_intf_pins Waveform_DMA/S_AXI_LITE]
connect_bd_intf_net [get_bd_intf_pins smartconnect_0/M00_AXI] [get_bd_intf_pins M00_AXI1]
connect_bd_intf_net [get_bd_intf_pins Waveform_DMA/M_AXI_S2MM] [get_bd_intf_pins smartconnect_0/S01_AXI]
connect_bd_intf_net [get_bd_intf_pins Waveform_DMA/M_AXI_SG] [get_bd_intf_pins smartconnect_0/S00_AXI]
connect_bd_net [get_bd_pins Waveform_DMA/s2mm_introut] [get_bd_pins s2mm_introut]
connect_bd_net -net proc_sys_reset_0_peripheral_aresetn [get_bd_pins aresetn] \
  [get_bd_pins Waveform_DMA/axi_resetn] [get_bd_pins smartconnect_0/aresetn]
connect_bd_net -net zynq_ultra_ps_e_0_pl_clk0 [get_bd_pins m_axi_s2mm_aclk] \
  [get_bd_pins Waveform_DMA/m_axi_s2mm_aclk] [get_bd_pins Waveform_DMA/m_axi_sg_aclk] \
  [get_bd_pins Waveform_DMA/s_axi_lite_aclk] [get_bd_pins smartconnect_0/aclk]

current_bd_instance /MeterLogic/Meter_DMA/Meter_data_AXI_grp
connect_bd_intf_net [get_bd_intf_pins S_AXIS_S2MM] [get_bd_intf_pins Meter_data_DMA/S_AXIS_S2MM]
connect_bd_intf_net [get_bd_intf_pins M00_AXI] [get_bd_intf_pins adc_dma_mem_smc/M00_AXI]
connect_bd_intf_net -intf_net axi_dma_0_M_AXI_S2MM [get_bd_intf_pins Meter_data_DMA/M_AXI_S2MM] [get_bd_intf_pins adc_dma_mem_smc/S01_AXI]
connect_bd_intf_net -intf_net axi_dma_0_M_AXI_SG [get_bd_intf_pins Meter_data_DMA/M_AXI_SG] [get_bd_intf_pins adc_dma_mem_smc/S00_AXI]
connect_bd_intf_net -intf_net smartconnect_0_M02_AXI [get_bd_intf_pins S_AXI_LITE] [get_bd_intf_pins Meter_data_DMA/S_AXI_LITE]
connect_bd_net [get_bd_pins Meter_data_DMA/s2mm_introut] [get_bd_pins s2mm_introut]
connect_bd_net -net proc_sys_reset_0_peripheral_aresetn [get_bd_pins aresetn] \
  [get_bd_pins adc_dma_mem_smc/aresetn] [get_bd_pins Meter_data_DMA/axi_resetn]
connect_bd_net -net zynq_ultra_ps_e_0_pl_clk0 [get_bd_pins m_axi_s2mm_aclk] \
  [get_bd_pins Meter_data_DMA/m_axi_s2mm_aclk] [get_bd_pins Meter_data_DMA/m_axi_sg_aclk] [get_bd_pins adc_dma_mem_smc/aclk] \
  [get_bd_pins Meter_data_DMA/s_axi_lite_aclk]

current_bd_instance /MeterLogic/MeterData_Buffer
connect_bd_intf_net [get_bd_intf_pins S_AXIS_R5_AGG] [get_bd_intf_pins R5_Aggregation_FIFO/S_AXI]
connect_bd_intf_net [get_bd_intf_pins AXI_STR_RXD] [get_bd_intf_pins R5_Aggregation_FIFO/AXI_STR_RXD]
connect_bd_intf_net [get_bd_intf_pins PQ_record_fifo/M_AXIS] [get_bd_intf_pins MeterData_AXI_Switch/S01_AXIS]
connect_bd_intf_net [get_bd_intf_pins R5_Aggregation_FIFO/AXI_STR_TXD] [get_bd_intf_pins MeterData_AXI_Switch/S02_AXIS]
connect_bd_intf_net [get_bd_intf_pins SCYC_record_fifo/M_AXIS] [get_bd_intf_pins MeterData_AXI_Switch/S00_AXIS]
connect_bd_intf_net [get_bd_intf_pins S_AXIS_HARMONIC] [get_bd_intf_pins MeterData_AXI_Switch/S03_AXIS]
connect_bd_intf_net [get_bd_intf_pins S_AXIS_PQ] [get_bd_intf_pins PQ_record_fifo/S_AXIS]
connect_bd_intf_net [get_bd_intf_pins S_AXIS_SCYC] [get_bd_intf_pins SCYC_record_fifo/S_AXIS]
connect_bd_intf_net -intf_net axis_switch_0_M00_AXIS [get_bd_intf_pins M00_AXIS] [get_bd_intf_pins MeterData_AXI_Switch/M00_AXIS]
connect_bd_net [get_bd_pins R5_Aggregation_FIFO/interrupt] [get_bd_pins interrupt]
connect_bd_net -net proc_sys_reset_0_peripheral_aresetn [get_bd_pins aresetn] \
  [get_bd_pins MeterData_AXI_Switch/aresetn] [get_bd_pins SCYC_record_fifo/s_axis_aresetn] \
  [get_bd_pins PQ_record_fifo/s_axis_aresetn] [get_bd_pins R5_Aggregation_FIFO/s_axi_aresetn]
connect_bd_net -net zynq_ultra_ps_e_0_pl_clk0 [get_bd_pins aclk] \
  [get_bd_pins MeterData_AXI_Switch/aclk] [get_bd_pins SCYC_record_fifo/s_axis_aclk] [get_bd_pins PQ_record_fifo/s_axis_aclk] \
  [get_bd_pins R5_Aggregation_FIFO/s_axi_aclk]

current_bd_instance /MeterLogic/Data_Computation
connect_bd_intf_net [get_bd_intf_pins MeterCore_Wrapper/S_AXI_TIME] [get_bd_intf_pins S_AXI_TIME]
connect_bd_intf_net [get_bd_intf_pins S_AXI_WAVEFORM] [get_bd_intf_pins MeterCore_Wrapper/S_AXI_WAVEFORM]
connect_bd_intf_net [get_bd_intf_pins MeterCore_Wrapper/M_AXIS_FFT_CONFIG] [get_bd_intf_pins Harmonic_xFFT/S_AXIS_CONFIG]
connect_bd_intf_net [get_bd_intf_pins MeterCore_Wrapper/M_AXIS_FFT_DATA] [get_bd_intf_pins Harmonic_xFFT/S_AXIS_DATA]
connect_bd_intf_net [get_bd_intf_pins M_AXIS_HARMONIC] [get_bd_intf_pins MeterCore_Wrapper/M_AXIS_HARMONIC]
connect_bd_intf_net [get_bd_intf_pins M_AXIS_PQ] [get_bd_intf_pins MeterCore_Wrapper/M_AXIS_PQ]
connect_bd_intf_net [get_bd_intf_pins M_AXIS_R5_AGG_INPUT] [get_bd_intf_pins MeterCore_Wrapper/M_AXIS_R5_AGG_INPUT]
connect_bd_intf_net [get_bd_intf_pins M_AXIS_SCYC] [get_bd_intf_pins MeterCore_Wrapper/M_AXIS_SCYC]
connect_bd_intf_net [get_bd_intf_pins M_AXIS_WAVEFORM] [get_bd_intf_pins MeterCore_Wrapper/M_AXIS_WAVEFORM]
connect_bd_intf_net [get_bd_intf_pins S_AXI_SIMULATOR] [get_bd_intf_pins MeterCore_Wrapper/S_AXI_SIMULATOR]
connect_bd_intf_net -intf_net smartconnect_0_M03_AXI [get_bd_intf_pins S_AXI_CONVERSION] [get_bd_intf_pins MeterCore_Wrapper/S_AXI_CONVERSION]
connect_bd_intf_net -intf_net smartconnect_0_M04_AXI [get_bd_intf_pins S_AXI_CAPTURE] [get_bd_intf_pins MeterCore_Wrapper/S_AXI_CAPTURE]
connect_bd_intf_net -intf_net smartconnect_0_M05_AXI [get_bd_intf_pins S_AXI_PROCESSING] [get_bd_intf_pins MeterCore_Wrapper/S_AXI_PROCESSING]
connect_bd_intf_net -intf_net xfft_0_M_AXIS_DATA [get_bd_intf_pins Harmonic_xFFT/M_AXIS_DATA] [get_bd_intf_pins MeterCore_Wrapper/S_AXIS_FFT_DATA]
connect_bd_intf_net -intf_net xfft_0_M_AXIS_STATUS [get_bd_intf_pins MeterCore_Wrapper/S_AXIS_FFT_STATUS] [get_bd_intf_pins Harmonic_xFFT/M_AXIS_STATUS]
connect_bd_net [get_bd_pins ADC_DCLK] [get_bd_pins MeterCore_Wrapper/adc_dclk]
connect_bd_net [get_bd_pins ADC_DOUT] [get_bd_pins MeterCore_Wrapper/adc_dout]
connect_bd_net [get_bd_pins ADC_DRDY_N] [get_bd_pins MeterCore_Wrapper/adc_drdy_n]
connect_bd_net -net MeterCore_Wrapper_0_adc_convst_sar [get_bd_pins MeterCore_Wrapper/adc_convst_sar] [get_bd_pins ADC_CONVST_SAR]
connect_bd_net -net MeterCore_Wrapper_0_adc_reset_n [get_bd_pins MeterCore_Wrapper/adc_reset_n] [get_bd_pins ADC_RESET_N]
connect_bd_net -net MeterCore_Wrapper_0_adc_start_n [get_bd_pins MeterCore_Wrapper/adc_start_n] [get_bd_pins ADC_START_N]
connect_bd_net -net proc_sys_reset_0_peripheral_aresetn [get_bd_pins aresetn] \
  [get_bd_pins Harmonic_xFFT/aresetn] [get_bd_pins MeterCore_Wrapper/aresetn]
connect_bd_net -net xfft_0_event_data_in_channel_halt [get_bd_pins Harmonic_xFFT/event_data_in_channel_halt] \
  [get_bd_pins MeterCore_Wrapper/xfft_event_data_in_channel_halt]
connect_bd_net -net xfft_0_event_data_out_channel_halt [get_bd_pins Harmonic_xFFT/event_data_out_channel_halt] \
  [get_bd_pins MeterCore_Wrapper/xfft_event_data_out_channel_halt]
connect_bd_net -net xfft_0_event_frame_started [get_bd_pins Harmonic_xFFT/event_frame_started] \
  [get_bd_pins MeterCore_Wrapper/xfft_event_frame_started]
connect_bd_net -net xfft_0_event_status_channel_halt [get_bd_pins Harmonic_xFFT/event_status_channel_halt] \
  [get_bd_pins MeterCore_Wrapper/xfft_event_status_channel_halt]
connect_bd_net -net xfft_0_event_tlast_missing [get_bd_pins Harmonic_xFFT/event_tlast_missing] \
  [get_bd_pins MeterCore_Wrapper/xfft_event_tlast_missing]
connect_bd_net -net xfft_0_event_tlast_unexpected [get_bd_pins Harmonic_xFFT/event_tlast_unexpected] \
  [get_bd_pins MeterCore_Wrapper/xfft_event_tlast_unexpected]
connect_bd_net -net zynq_ultra_ps_e_0_pl_clk0 [get_bd_pins aclk] [get_bd_pins Harmonic_xFFT/aclk] [get_bd_pins MeterCore_Wrapper/aclk]

current_bd_instance /ZYNQ_System
connect_bd_intf_net -intf_net MeterLogic_M00_AXI [get_bd_intf_pins S_AXI_HP0_FPD] [get_bd_intf_pins zynq_ultra_ps_e_0/S_AXI_HP0_FPD]
connect_bd_intf_net [get_bd_intf_pins S_AXI_HP1_FPD] [get_bd_intf_pins zynq_ultra_ps_e_0/S_AXI_HP1_FPD]
connect_bd_intf_net [get_bd_intf_pins M00_AXI] [get_bd_intf_pins smartconnect_0/M00_AXI]
connect_bd_intf_net [get_bd_intf_pins M01_AXI] [get_bd_intf_pins smartconnect_0/M01_AXI]
connect_bd_intf_net [get_bd_intf_pins M02_AXI] [get_bd_intf_pins smartconnect_0/M02_AXI]
connect_bd_intf_net [get_bd_intf_pins M03_AXI] [get_bd_intf_pins smartconnect_0/M03_AXI]
connect_bd_intf_net [get_bd_intf_pins M04_AXI] [get_bd_intf_pins smartconnect_0/M04_AXI]
connect_bd_intf_net [get_bd_intf_pins M05_AXI] [get_bd_intf_pins smartconnect_0/M05_AXI]
connect_bd_intf_net [get_bd_intf_pins M06_AXI] [get_bd_intf_pins smartconnect_0/M06_AXI]
connect_bd_intf_net [get_bd_intf_pins M07_AXI] [get_bd_intf_pins smartconnect_0/M07_AXI]
connect_bd_intf_net [get_bd_intf_pins M08_AXI] [get_bd_intf_pins smartconnect_0/M08_AXI]
connect_bd_intf_net [get_bd_intf_pins M09_AXI] [get_bd_intf_pins smartconnect_0/M09_AXI]
connect_bd_intf_net [get_bd_intf_pins M10_AXI] [get_bd_intf_pins smartconnect_0/M10_AXI]
connect_bd_intf_net [get_bd_intf_pins zynq_ultra_ps_e_0/M_AXI_HPM0_FPD] [get_bd_intf_pins smartconnect_0/S01_AXI]
connect_bd_intf_net [get_bd_intf_pins zynq_ultra_ps_e_0/M_AXI_HPM0_LPD] [get_bd_intf_pins smartconnect_0/S02_AXI]
connect_bd_intf_net [get_bd_intf_pins zynq_ultra_ps_e_0/M_AXI_HPM1_FPD] [get_bd_intf_pins smartconnect_0/S00_AXI]
connect_bd_net -net MeterLogic_s2mm_introut [get_bd_pins pl_ps_irq0] [get_bd_pins zynq_ultra_ps_e_0/pl_ps_irq0]
connect_bd_net [get_bd_pins proc_sys_reset_0/peripheral_aresetn] [get_bd_pins aresetn] [get_bd_pins smartconnect_0/aresetn]
connect_bd_net [get_bd_pins zynq_ultra_ps_e_0/emio_ttc0_wave_o] [get_bd_pins emio_ttc0_wave_o]
connect_bd_net [get_bd_pins zynq_ultra_ps_e_0/pl_clk0] \
  [get_bd_pins pl_clk0] [get_bd_pins proc_sys_reset_0/slowest_sync_clk] [get_bd_pins zynq_ultra_ps_e_0/maxihpm1_fpd_aclk] \
  [get_bd_pins smartconnect_0/aclk] [get_bd_pins zynq_ultra_ps_e_0/saxihp0_fpd_aclk] \
  [get_bd_pins zynq_ultra_ps_e_0/maxihpm0_fpd_aclk] [get_bd_pins zynq_ultra_ps_e_0/saxihp1_fpd_aclk] \
  [get_bd_pins zynq_ultra_ps_e_0/maxihpm0_lpd_aclk]
connect_bd_net [get_bd_pins zynq_ultra_ps_e_0/pl_resetn0] [get_bd_pins proc_sys_reset_0/ext_reset_in]

current_bd_instance /
connect_bd_intf_net [get_bd_intf_pins ZYNQ_System/S_AXI_HP0_FPD] [get_bd_intf_pins MeterLogic/M00_AXI]
connect_bd_intf_net [get_bd_intf_pins MeterLogic/M00_AXI1] [get_bd_intf_pins ZYNQ_System/S_AXI_HP1_FPD]
connect_bd_intf_net [get_bd_intf_pins ZYNQ_System/M08_AXI] [get_bd_intf_pins MeterLogic/S_AXI_SIMULATOR]
connect_bd_intf_net -intf_net StatusSignal_0_RPU_HeatBeat_Signal [get_bd_intf_ports UF2_LED] [get_bd_intf_pins System_Native_Peripherals/UF2_LED]
connect_bd_intf_net [get_bd_intf_pins ZYNQ_System/M07_AXI] [get_bd_intf_pins MeterLogic/S_AXI_LITE1]
connect_bd_intf_net [get_bd_intf_pins ZYNQ_System/M09_AXI] [get_bd_intf_pins MeterLogic/S_AXIS_R5_AGG]
connect_bd_intf_net [get_bd_intf_pins ZYNQ_System/M10_AXI] [get_bd_intf_pins MeterLogic/S_AXI_TIME]
connect_bd_intf_net -intf_net axi_quad_spi_0_SPI_0 [get_bd_intf_ports EXT_ADC_SPI] [get_bd_intf_pins MeterLogic/EXT_ADC_SPI]
connect_bd_intf_net -intf_net smartconnect_0_M00_AXI [get_bd_intf_pins ZYNQ_System/M00_AXI] [get_bd_intf_pins System_Native_Peripherals/S_AXI_0]
connect_bd_intf_net -intf_net smartconnect_0_M01_AXI [get_bd_intf_pins ZYNQ_System/M01_AXI] [get_bd_intf_pins MeterLogic/AXI_LITE]
connect_bd_intf_net -intf_net smartconnect_0_M02_AXI [get_bd_intf_pins ZYNQ_System/M02_AXI] [get_bd_intf_pins MeterLogic/S_AXI_LITE]
connect_bd_intf_net -intf_net smartconnect_0_M03_AXI [get_bd_intf_pins ZYNQ_System/M03_AXI] [get_bd_intf_pins MeterLogic/s_axi_conversion]
connect_bd_intf_net -intf_net smartconnect_0_M04_AXI [get_bd_intf_pins ZYNQ_System/M04_AXI] [get_bd_intf_pins MeterLogic/s_axi_capture]
connect_bd_intf_net -intf_net smartconnect_0_M05_AXI [get_bd_intf_pins ZYNQ_System/M05_AXI] [get_bd_intf_pins MeterLogic/s_axi_processing]
connect_bd_intf_net -intf_net smartconnect_0_M06_AXI [get_bd_intf_pins ZYNQ_System/M06_AXI] [get_bd_intf_pins MeterLogic/S_AXI_WAVEFORM]
connect_bd_net [get_bd_ports ADC_DCLK] [get_bd_pins MeterLogic/ADC_DCLK]
connect_bd_net [get_bd_ports ADC_DOUT] [get_bd_pins MeterLogic/ADC_DOUT]
connect_bd_net [get_bd_ports ADC_DRDY_N] [get_bd_pins MeterLogic/ADC_DRDY_N]
connect_bd_net -net FanControl_0_KR260_Fan_PWM [get_bd_pins System_Native_Peripherals/KR260_Fan_PWM] [get_bd_ports KR260_Fan_PWM]
connect_bd_net -net MeterCore_Wrapper_0_adc_convst_sar [get_bd_pins MeterLogic/ADC_CONVST_SAR] [get_bd_ports ADC_CONVST_SAR]
connect_bd_net -net MeterCore_Wrapper_0_adc_reset_n [get_bd_pins MeterLogic/ADC_RESET_N] [get_bd_ports ADC_RESET_N]
connect_bd_net -net MeterCore_Wrapper_0_adc_start_n [get_bd_pins MeterLogic/ADC_START_N] [get_bd_ports ADC_START_N]
connect_bd_net [get_bd_pins MeterLogic/s2mm_introut] [get_bd_pins ZYNQ_System/pl_ps_irq0]
connect_bd_net -net StatusSignal_0_PL_HeatBeat_Signal [get_bd_pins System_Native_Peripherals/UF1_LED] [get_bd_ports UF1_LED]
connect_bd_net -net proc_sys_reset_0_peripheral_aresetn [get_bd_pins ZYNQ_System/aresetn] \
  [get_bd_pins System_Native_Peripherals/s_axi_aresetn_0] [get_bd_pins MeterLogic/aresetn]
connect_bd_net -net zynq_ultra_ps_e_0_emio_ttc0_wave_o [get_bd_pins ZYNQ_System/emio_ttc0_wave_o] [get_bd_pins System_Native_Peripherals/Din_0]
connect_bd_net -net zynq_ultra_ps_e_0_pl_clk0 [get_bd_pins ZYNQ_System/pl_clk0] \
  [get_bd_pins System_Native_Peripherals/s_axi_aclk_0] [get_bd_pins MeterLogic/aclk]

# ---- address map ----
assign_bd_address -offset 0x00000000 -range 2G -target_address_space [get_bd_addr_spaces MeterLogic/Meter_DMA/Meter_data_AXI_grp/Meter_data_DMA/Data_S2MM] [get_bd_addr_segs ZYNQ_System/zynq_ultra_ps_e_0/SAXIGP2/HP0_DDR_LOW]
exclude_bd_addr_seg -offset 0x00000000 -range 1 -target_address_space [get_bd_addr_spaces MeterLogic/Meter_DMA/Meter_data_AXI_grp/Meter_data_DMA/Data_S2MM] [get_bd_addr_segs ZYNQ_System/zynq_ultra_ps_e_0/SAXIGP2/HP0_DDR_HIGH]
exclude_bd_addr_seg -offset 0xC0000000 -range 512M -target_address_space [get_bd_addr_spaces MeterLogic/Meter_DMA/Meter_data_AXI_grp/Meter_data_DMA/Data_S2MM] [get_bd_addr_segs ZYNQ_System/zynq_ultra_ps_e_0/SAXIGP2/HP0_QSPI]
exclude_bd_addr_seg -offset 0xFF000000 -range 16M -target_address_space [get_bd_addr_spaces MeterLogic/Meter_DMA/Meter_data_AXI_grp/Meter_data_DMA/Data_S2MM] [get_bd_addr_segs ZYNQ_System/zynq_ultra_ps_e_0/SAXIGP2/HP0_LPS_OCM]
assign_bd_address -offset 0x00000000 -range 2G -target_address_space [get_bd_addr_spaces MeterLogic/Meter_DMA/Meter_data_AXI_grp/Meter_data_DMA/Data_SG] [get_bd_addr_segs ZYNQ_System/zynq_ultra_ps_e_0/SAXIGP2/HP0_DDR_LOW]
exclude_bd_addr_seg -offset 0x00000000 -range 1 -target_address_space [get_bd_addr_spaces MeterLogic/Meter_DMA/Meter_data_AXI_grp/Meter_data_DMA/Data_SG] [get_bd_addr_segs ZYNQ_System/zynq_ultra_ps_e_0/SAXIGP2/HP0_DDR_HIGH]
exclude_bd_addr_seg -offset 0xC0000000 -range 512M -target_address_space [get_bd_addr_spaces MeterLogic/Meter_DMA/Meter_data_AXI_grp/Meter_data_DMA/Data_SG] [get_bd_addr_segs ZYNQ_System/zynq_ultra_ps_e_0/SAXIGP2/HP0_QSPI]
exclude_bd_addr_seg -offset 0xFF000000 -range 16M -target_address_space [get_bd_addr_spaces MeterLogic/Meter_DMA/Meter_data_AXI_grp/Meter_data_DMA/Data_SG] [get_bd_addr_segs ZYNQ_System/zynq_ultra_ps_e_0/SAXIGP2/HP0_LPS_OCM]
assign_bd_address -offset 0x00000000 -range 2G -target_address_space [get_bd_addr_spaces MeterLogic/Meter_DMA/Waveform_AXI_grp/Waveform_DMA/Data_S2MM] [get_bd_addr_segs ZYNQ_System/zynq_ultra_ps_e_0/SAXIGP3/HP1_DDR_LOW]
exclude_bd_addr_seg -offset 0x00000000 -range 1 -target_address_space [get_bd_addr_spaces MeterLogic/Meter_DMA/Waveform_AXI_grp/Waveform_DMA/Data_S2MM] [get_bd_addr_segs ZYNQ_System/zynq_ultra_ps_e_0/SAXIGP3/HP1_DDR_HIGH]
exclude_bd_addr_seg -offset 0x00000000 -range 1 -target_address_space [get_bd_addr_spaces MeterLogic/Meter_DMA/Waveform_AXI_grp/Waveform_DMA/Data_S2MM] [get_bd_addr_segs ZYNQ_System/zynq_ultra_ps_e_0/SAXIGP3/HP1_LPS_OCM]
exclude_bd_addr_seg -offset 0x00000000 -range 1 -target_address_space [get_bd_addr_spaces MeterLogic/Meter_DMA/Waveform_AXI_grp/Waveform_DMA/Data_S2MM] [get_bd_addr_segs ZYNQ_System/zynq_ultra_ps_e_0/SAXIGP3/HP1_QSPI]
assign_bd_address -offset 0x00000000 -range 2G -target_address_space [get_bd_addr_spaces MeterLogic/Meter_DMA/Waveform_AXI_grp/Waveform_DMA/Data_SG] [get_bd_addr_segs ZYNQ_System/zynq_ultra_ps_e_0/SAXIGP3/HP1_DDR_LOW]
exclude_bd_addr_seg -offset 0x00000000 -range 1 -target_address_space [get_bd_addr_spaces MeterLogic/Meter_DMA/Waveform_AXI_grp/Waveform_DMA/Data_SG] [get_bd_addr_segs ZYNQ_System/zynq_ultra_ps_e_0/SAXIGP3/HP1_DDR_HIGH]
exclude_bd_addr_seg -offset 0x00000000 -range 1 -target_address_space [get_bd_addr_spaces MeterLogic/Meter_DMA/Waveform_AXI_grp/Waveform_DMA/Data_SG] [get_bd_addr_segs ZYNQ_System/zynq_ultra_ps_e_0/SAXIGP3/HP1_LPS_OCM]
exclude_bd_addr_seg -offset 0x00000000 -range 1 -target_address_space [get_bd_addr_spaces MeterLogic/Meter_DMA/Waveform_AXI_grp/Waveform_DMA/Data_SG] [get_bd_addr_segs ZYNQ_System/zynq_ultra_ps_e_0/SAXIGP3/HP1_QSPI]
assign_bd_address -offset 0x00B0000000 -range 64K -target_address_space [get_bd_addr_spaces ZYNQ_System/zynq_ultra_ps_e_0/Data] [get_bd_addr_segs System_Native_Peripherals/HeatBeat/RPU_HeartBeat_GPIO_Ctrl/S_AXI/Reg]
assign_bd_address -offset 0x00B0010000 -range 64K -target_address_space [get_bd_addr_spaces ZYNQ_System/zynq_ultra_ps_e_0/Data] [get_bd_addr_segs MeterLogic/ADC_SPI/AXI_LITE/Reg]
assign_bd_address -offset 0x00B0020000 -range 64K -target_address_space [get_bd_addr_spaces ZYNQ_System/zynq_ultra_ps_e_0/Data] [get_bd_addr_segs MeterLogic/Data_Computation/MeterCore_Wrapper/S_AXI_CAPTURE/reg0]
assign_bd_address -offset 0x00B0030000 -range 64K -target_address_space [get_bd_addr_spaces ZYNQ_System/zynq_ultra_ps_e_0/Data] [get_bd_addr_segs MeterLogic/Meter_DMA/Meter_data_AXI_grp/Meter_data_DMA/S_AXI_LITE/Reg]
assign_bd_address -offset 0x00B0040000 -range 64K -target_address_space [get_bd_addr_spaces ZYNQ_System/zynq_ultra_ps_e_0/Data] [get_bd_addr_segs MeterLogic/Data_Computation/MeterCore_Wrapper/S_AXI_CONVERSION/reg0]
assign_bd_address -offset 0x00B0050000 -range 64K -target_address_space [get_bd_addr_spaces ZYNQ_System/zynq_ultra_ps_e_0/Data] [get_bd_addr_segs MeterLogic/Data_Computation/MeterCore_Wrapper/S_AXI_PROCESSING/reg0]
assign_bd_address -offset 0x00B0060000 -range 64K -target_address_space [get_bd_addr_spaces ZYNQ_System/zynq_ultra_ps_e_0/Data] [get_bd_addr_segs MeterLogic/Meter_DMA/Waveform_AXI_grp/Waveform_DMA/S_AXI_LITE/Reg]
assign_bd_address -offset 0x00B0070000 -range 64K -target_address_space [get_bd_addr_spaces ZYNQ_System/zynq_ultra_ps_e_0/Data] [get_bd_addr_segs MeterLogic/Data_Computation/MeterCore_Wrapper/S_AXI_WAVEFORM/reg0]
assign_bd_address -offset 0x00B0080000 -range 64K -target_address_space [get_bd_addr_spaces ZYNQ_System/zynq_ultra_ps_e_0/Data] [get_bd_addr_segs MeterLogic/Data_Computation/MeterCore_Wrapper/S_AXI_SIMULATOR/reg0]
assign_bd_address -offset 0x00B0090000 -range 64K -target_address_space [get_bd_addr_spaces ZYNQ_System/zynq_ultra_ps_e_0/Data] [get_bd_addr_segs MeterLogic/MeterData_Buffer/R5_Aggregation_FIFO/S_AXI/Mem0]
assign_bd_address -offset 0x00B00A0000 -range 64K -target_address_space [get_bd_addr_spaces ZYNQ_System/zynq_ultra_ps_e_0/Data] [get_bd_addr_segs MeterLogic/Data_Computation/MeterCore_Wrapper/S_AXI_TIME/reg0]

validate_bd_design
save_bd_design
